# EAGLE schematic LMH6881-Breakout (EAGLE 7.3.0)
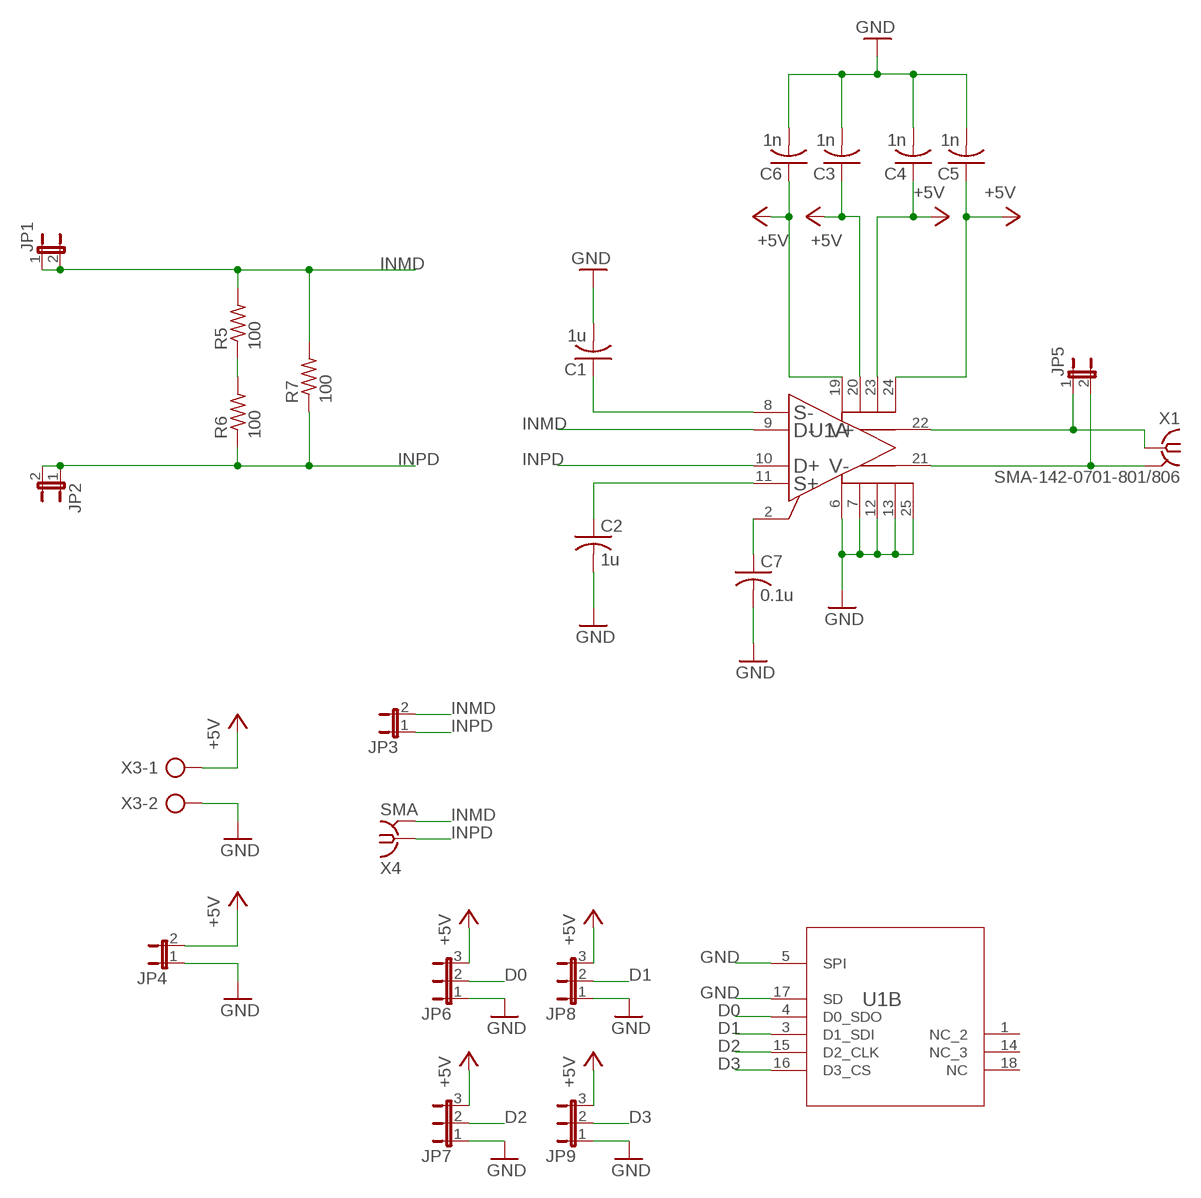
[diagram p0: schematic, sheet 1]

## Parts
C1  1u  C-USC0805  [C0805]
C2  1u  C-USC0805  [C0805]
C3  1n  C-USC0805  [C0805]
C4  1n  C-USC0805  [C0805]
C5  1n  C-USC0805  [C0805]
C6  1n  C-USC0805  [C0805]
C7  0.1u  C-USC0805  [C0805]
JP1  JP1E  [JP1]
JP2  JP1E  [JP1]
JP3  JP1E  [JP1]
JP4  JP1E  [JP1]
JP5  JP1E  [JP1]
JP6  JP2E  [JP2]
JP7  JP2E  [JP2]
JP8  JP2E  [JP2]
JP9  JP2E  [JP2]
R5  100  R-US_R0805  [R0805]
R6  100  R-US_R0805  [R0805]
R7  100  R-US_R0805  [R0805]
U1  LMH6881SQX/NOPB  [RTW0024A]
X1  SMA-142-0701-801/806  [J502-ND-142-0701-801/806]
X3  AK500/2  [AK500/2]
X4  SMA  SMA-142-0701-801/806  [J502-ND-142-0701-801/806]

## Nets
+5V: C3.1 C4.1 C5.1 C6.1 JP4.2 JP6.3 JP7.3 JP8.3 JP9.3 U1.19(A:VCC_2) U1.20(A:VCC_3) U1.23(A:VCC_4) U1.24(A:VCC) X3.1
D0: JP6.2 U1.4(B:D0_SDO)
D1: JP8.2 U1.3(B:D1_SDI)
D2: JP7.2 U1.15(B:D2_CLK)
D3: JP9.2 U1.16(B:D3_CS)
GND: C1.2 C2.2 C3.2 C4.2 C5.2 C6.2 C7.2 JP4.1 JP6.1 JP7.1 JP8.1 JP9.1 U1.5(B:SPI) U1.6(A:GND_2) U1.7(A:GND_3) U1.12(A:GND_4) U1.13(A:GND) U1.17(B:SD) U1.25(A:PAD) X3.2
INMD: JP1.1 JP1.2 JP3.2 R5.2 R7.2 U1.9(A:INMD) X4.G@1 X4.G@2 X4.G@3 X4.G@4
INPD: JP2.1 JP2.2 JP3.1 R6.1 R7.1 U1.10(A:INPD) X4.1
N$1: C7.1 U1.2(A:OCM)
N$3: C1.1 U1.8(A:INMS)
N$4: C2.1 U1.11(A:INPS)
N$5: JP5.1 U1.22(A:OUTP) X1.1
N$6: JP5.2 U1.21(A:OUTM) X1.G@1 X1.G@2 X1.G@3 X1.G@4
N$7: R5.1 R6.2
Unconnected: U1.1(B:NC_2) U1.14(B:NC_3) U1.18(B:NC)

## Library data of the parts
C1-C7 = resistor:C-US: CAPACITOR, American symbol
JP1-JP5 = jumper:JP1E: JUMPER
JP6-JP9 = jumper:JP2E: JUMPER
R5-R7 = resistor:R-US_: RESISTOR, American symbol
U1 = LMH6881:LMH6881SQX/NOPB; ALTERNATEPARTNUMBER: LMH6881SQNOPB; APPLICATION_BUILDNUMBER: *; COMPTYPE: IC; MANUFACTURER: Texas Instruments; MOUNTTYPE: SMT; PACKAGEREFERENCE: RTW0024A; PARTNUMBER: LMH6881SQXNOPB; PIN_COUNT: 25; REFDES: RefDes; ROHS: Y; TYPE: TYPE; VALUE: Value
X1 X4 = con-coax:SMA-: SMA 50 Ohm End Launch Jack Receptacle - Round Contact Johnson Components Source: www.johnsoncomponents.com .. J502-ND.pdf; MF: JOHNSON COMPONENTS; MPN: 142-0701-801; OC_FARNELL: 1608592; OC_NEWARK: 90F2624
X3 = con-ptr500:AK500/2: CONNECTOR; OC_FARNELL: unknown; OC_NEWARK: unknown